# Altium schematic sheet FPGA_Memory.SchDoc
size A3
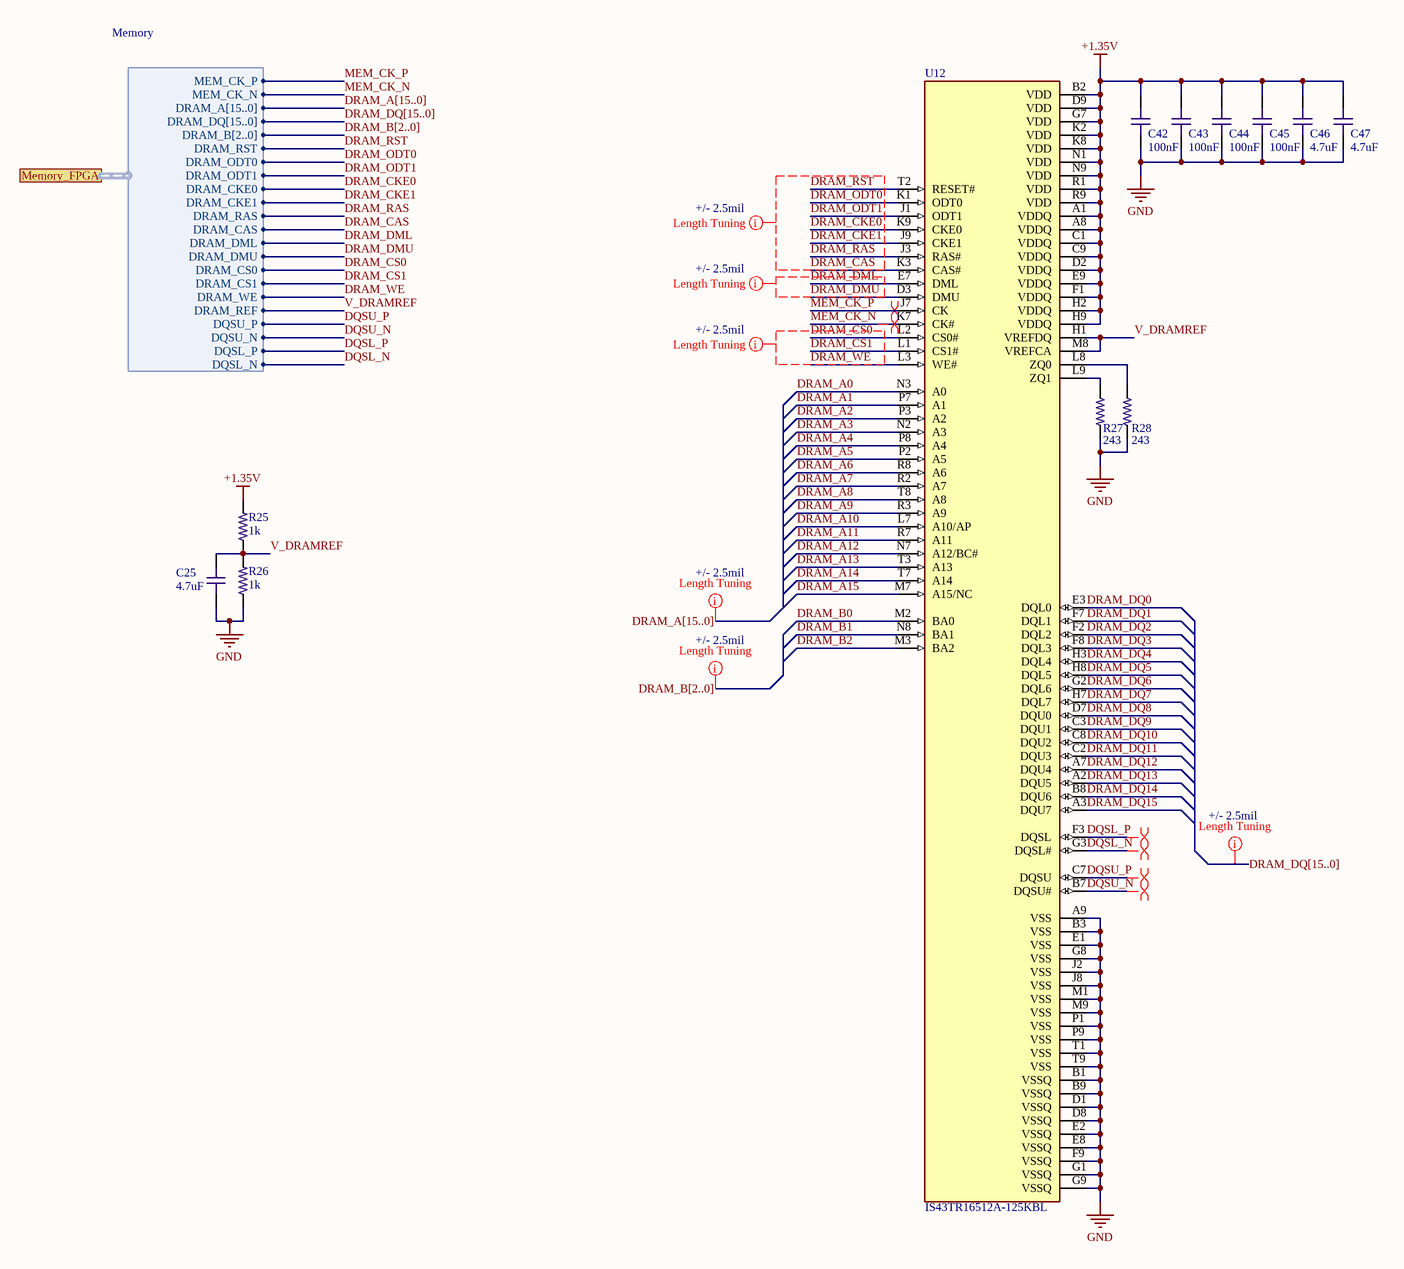
[diagram p0: FPGA_Memory.SchDoc]

## Parts
C25  value 4.7uF  [C0603-HIGH-DENSITY]  (hidden comment: 4.7uF, 25V, X5R, 0603)
C42  value 100nF  [C0603-HIGH-DENSITY]  (hidden comment: C0603 100nF 25V X7R)
C43  value 100nF  [C0603-HIGH-DENSITY]  (hidden comment: C0603 100nF 25V X7R)
C44  value 100nF  [C0603-HIGH-DENSITY]  (hidden comment: C0603 100nF 25V X7R)
C45  value 100nF  [C0603-HIGH-DENSITY]  (hidden comment: C0603 100nF 25V X7R)
C46  value 4.7uF  [C0603-HIGH-DENSITY]  (hidden comment: 4.7uF, 25V, X5R, 0603)
C47  value 4.7uF  [C0603-HIGH-DENSITY]  (hidden comment: 4.7uF, 25V, X5R, 0603)
R25  value 1k  [R0603-IPC-1K]  (hidden comment: R0603 1K 1%)
R26  value 1k  [R0603-IPC-1K]  (hidden comment: R0603 1K 1%)
R27  value 243  [R0603-IPC]  (hidden comment: R0603 243 1%)
R28  value 243  [R0603-IPC]  (hidden comment: R0603 243 1%)
U12  IS43TR16512A-125KBL  [BGA96C80P9X16_1000X1400X140N]

## Ports
Memory_FPGA (harness Memory)

## Harnesses
Memory: MEM_CK_P, MEM_CK_N, DRAM_A[15..0], DRAM_DQ[15..0], DRAM_B[2..0], DRAM_RST, DRAM_ODT0, DRAM_ODT1, DRAM_CKE0, DRAM_CKE1, DRAM_RAS, DRAM_CAS, DRAM_DML, DRAM_DMU, DRAM_CS0, DRAM_CS1, DRAM_WE, DRAM_REF, DQSU_P, DQSU_N, DQSL_P, DQSL_N

## Nets
+1.35V: C42.2 C43.2 C44.2 C45.2 C46.2 C47.2 R25.2 U12.A1(VDDQ) U12.A8(VDDQ) U12.B2(VDD) U12.C1(VDDQ) U12.C9(VDDQ) U12.D2(VDDQ) U12.D9(VDD) U12.E9(VDDQ) U12.F1(VDDQ) U12.G7(VDD) U12.H2(VDDQ) U12.H9(VDDQ) U12.K2(VDD) U12.K8(VDD) U12.N1(VDD) U12.N9(VDD) U12.R1(VDD) U12.R9(VDD)
GND: C25.1 C42.1 C43.1 C44.1 C45.1 C46.1 C47.1 R26.1 R27.2 R28.2 U12.A9(VSS) U12.B1(VSSQ) U12.B3(VSS) U12.B9(VSSQ) U12.D1(VSSQ) U12.D8(VSSQ) U12.E1(VSS) U12.E2(VSSQ) U12.E8(VSSQ) U12.F9(VSSQ) U12.G1(VSSQ) U12.G8(VSS) U12.G9(VSSQ) U12.J2(VSS) U12.J8(VSS) U12.M1(VSS) U12.M9(VSS) U12.P1(VSS) U12.P9(VSS) U12.T1(VSS) U12.T9(VSS)
DQSL_N: U12.G3(DQSL#) ; port Memory_FPGA.DQSL_N
DQSL_P: U12.F3(DQSL) ; port Memory_FPGA.DQSL_P
DQSU_N: U12.B7(DQSU#) ; port Memory_FPGA.DQSU_N
DQSU_P: U12.C7(DQSU) ; port Memory_FPGA.DQSU_P
DRAM_A0: U12.N3(A0)
DRAM_A1: U12.P7(A1)
DRAM_A2: U12.P3(A2)
DRAM_A3: U12.N2(A3)
DRAM_A4: U12.P8(A4)
DRAM_A5: U12.P2(A5)
DRAM_A6: U12.R8(A6)
DRAM_A7: U12.R2(A7)
DRAM_A8: U12.T8(A8)
DRAM_A9: U12.R3(A9)
DRAM_A10: U12.L7(A10/AP)
DRAM_A11: U12.R7(A11)
DRAM_A12: U12.N7(A12/BC#)
DRAM_A13: U12.T3(A13)
DRAM_A14: U12.T7(A14)
DRAM_A15: U12.M7(A15/NC)
DRAM_B0: U12.M2(BA0)
DRAM_B1: U12.N8(BA1)
DRAM_B2: U12.M3(BA2)
DRAM_CAS: U12.K3(CAS#) ; port Memory_FPGA.DRAM_CAS
DRAM_CKE0: U12.K9(CKE0) ; port Memory_FPGA.DRAM_CKE0
DRAM_CKE1: U12.J9(CKE1) ; port Memory_FPGA.DRAM_CKE1
DRAM_CS0: U12.L2(CS0#) ; port Memory_FPGA.DRAM_CS0
DRAM_CS1: U12.L1(CS1#) ; port Memory_FPGA.DRAM_CS1
DRAM_DML: U12.E7(DML) ; port Memory_FPGA.DRAM_DML
DRAM_DMU: U12.D3(DMU) ; port Memory_FPGA.DRAM_DMU
DRAM_DQ0: U12.E3(DQL0)
DRAM_DQ1: U12.F7(DQL1)
DRAM_DQ2: U12.F2(DQL2)
DRAM_DQ3: U12.F8(DQL3)
DRAM_DQ4: U12.H3(DQL4)
DRAM_DQ5: U12.H8(DQL5)
DRAM_DQ6: U12.G2(DQL6)
DRAM_DQ7: U12.H7(DQL7)
DRAM_DQ8: U12.D7(DQU0)
DRAM_DQ9: U12.C3(DQU1)
DRAM_DQ10: U12.C8(DQU2)
DRAM_DQ11: U12.C2(DQU3)
DRAM_DQ12: U12.A7(DQU4)
DRAM_DQ13: U12.A2(DQU5)
DRAM_DQ14: U12.B8(DQU6)
DRAM_DQ15: U12.A3(DQU7)
DRAM_ODT0: U12.K1(ODT0) ; port Memory_FPGA.DRAM_ODT0
DRAM_ODT1: U12.J1(ODT1) ; port Memory_FPGA.DRAM_ODT1
DRAM_RAS: U12.J3(RAS#) ; port Memory_FPGA.DRAM_RAS
DRAM_RST: U12.T2(RESET#) ; port Memory_FPGA.DRAM_RST
DRAM_WE: U12.L3(WE#) ; port Memory_FPGA.DRAM_WE
MEM_CK_N: U12.K7(CK#) ; port Memory_FPGA.MEM_CK_N
MEM_CK_P: U12.J7(CK) ; port Memory_FPGA.MEM_CK_P
V_DRAMREF: C25.2 R25.1 R26.2 U12.H1(VREFDQ) U12.M8(VREFCA) ; port Memory_FPGA.DRAM_REF
NetR27_1: R27.1 U12.L9(ZQ1)
NetR28_1: R28.1 U12.L8(ZQ0)

## Buses and harness runs
bus DRAM_A[15..0]
bus DRAM_B[2..0]
bus DRAM_DQ[15..0]

## Layout directives
net class DRAM_DATA - 150mil; rule Matched Net Lengths [Tolerance = 5mil]: (no net found under the mark), DRAM_DML, DRAM_DMU
net class DRAM_ADD - 150mil; rule Matched Net Lengths [Tolerance = 5mil]: (no net found under the mark), DRAM_CAS, DRAM_CKE0, DRAM_CKE1, DRAM_CS0, DRAM_CS1, DRAM_ODT0, DRAM_ODT1, DRAM_RAS, DRAM_RST, DRAM_WE
differential pair; differential pair class MEM_CLK; net class DIFF100: MEM_CK_N, MEM_CK_P
differential pair; differential pair class DQSL; net class DIFF100: DQSL_N, DQSL_P
differential pair; differential pair class DQSU; net class DIFF100: DQSU_N, DQSU_P

## Notes on the sheet
- +/- 2.5mil

## Library data of the parts
C25 C46 C47 = C0603 4.7uF 25V X5R: Chip Capacitor, 0603, 4.7uF, 25V, X5R; EIA Code: X5R; Max. Voltage: 25V; Supplier 1: Digi-Key; Supplier 2: Mouser; Supplier 3: LCSC; Supplier Part Number 1: 490-7203-1-ND; Supplier Part Number 2: 81-GRM188R61E475KE1D; Supplier Part Number 3: C90057
C42-C45 = C0603 100nF 25V X7R: Chip Capacitor, 0603, 100nF, 25V, X7R; EIA Code: X7R; Max. Voltage: 25V; Supplier 1: Digi-Key; Supplier Part Number 1: 490-1524-1-ND
R25 R26 = R0603 1K 1%: RES SMD 1K OHM 1% 1/10W 0603; Temperature Coefficient: ±100ppm/°C; Operating Temperature: -55°C ~ 155°C; Features: Automotive AEC-Q200; Tolerance: ±1%; Supplier 1: Digi-Key; Supplier Part Number 1: RMCF0603FG1K00CT-ND
R27 R28 = R0603 243 1%: RES SMD 243 OHM 1% 1/10W 0603; Temperature Coefficient: ±100ppm/°C; Tolerance: ±1%; Features: Automotive AEC-Q200; Operating Temperature: -55°C ~ 155°C; Supplier 1: Digi-Key; Supplier Part Number 1: RMCF0603FT243RCT-ND
U12 = IS43TR16512A/L-125KBL: SDRAM - DDR3L Memory IC 8Gb (512M x 16) Parallel 800MHz 20ns 96-LFBGA (10x14); MF: ISSI, Integrated; MP: IS43TR16512AL-125KBL; Package: LFBGA-96 ISSI; Supplier 1: Digi-Key; Supplier 2: Mouser; Supplier Part Number 1: 706-1459-ND; Supplier Part Number 2: 870-43TR16512A125KBL